# Altium project EM.PrjPCB
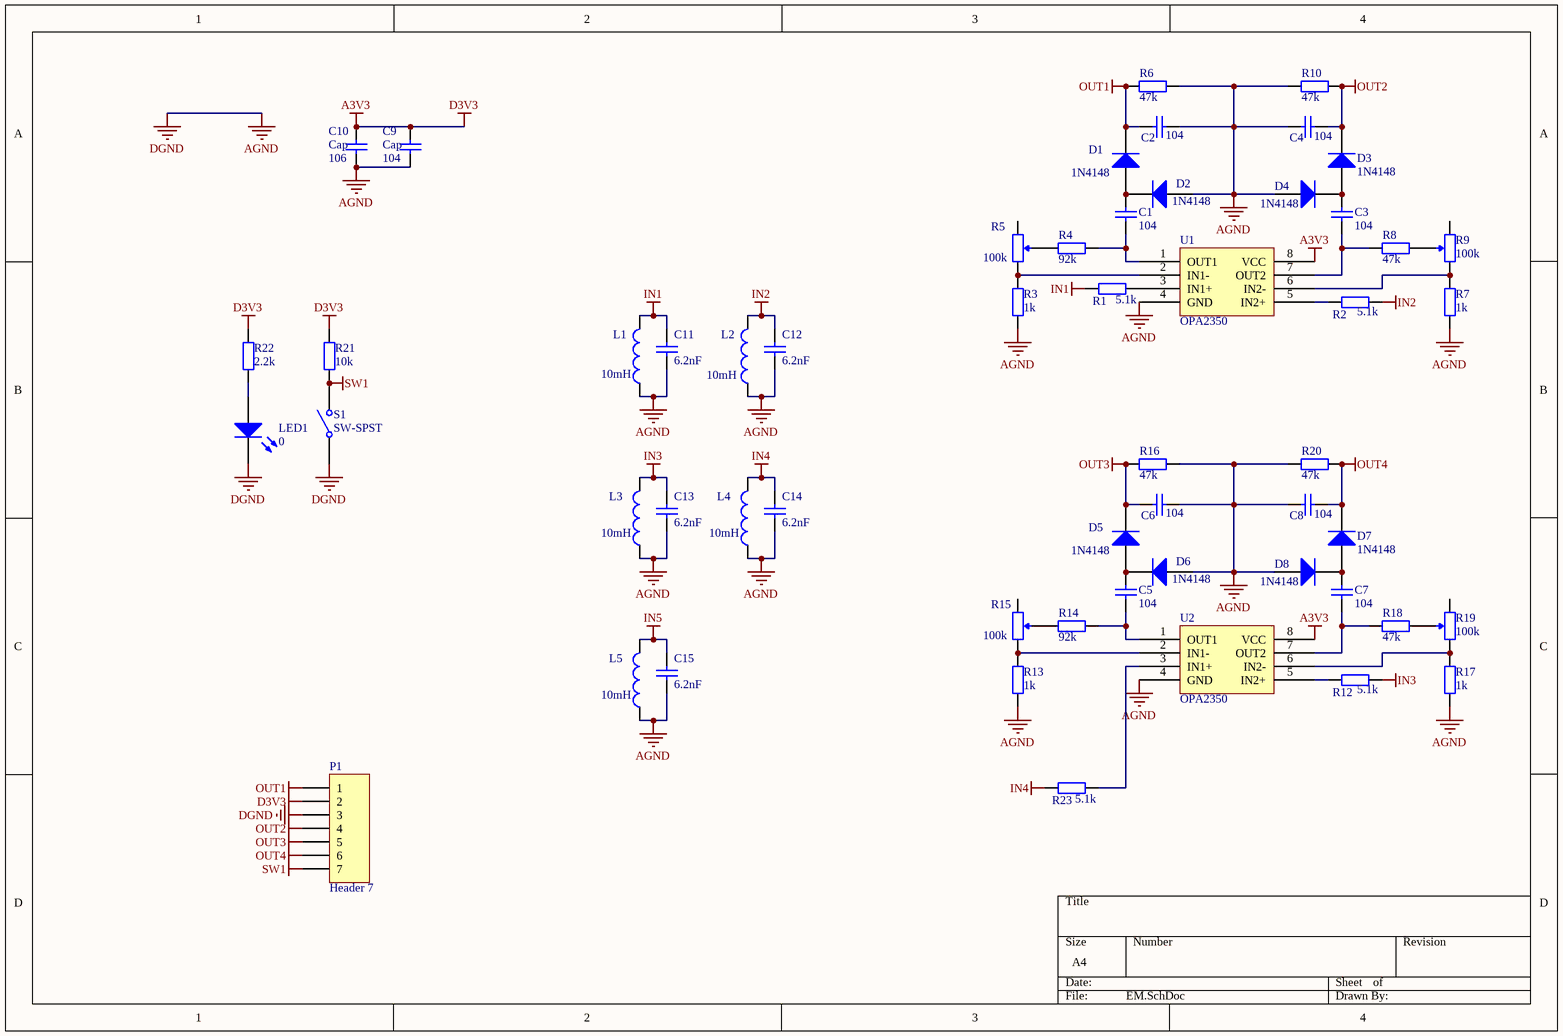
[diagram p0: EM.SchDoc]
2 sheets, 66 parts. Net scope: global (net labels, ports and power ports of the same name join across sheets).
Board files: EM.PcbDoc, ganhuangguan.PcbDoc
Sheets:
  EM.SchDoc
  Ganhuangguan.SchDoc

## Sheet EM.SchDoc
size A4

### Parts
C1  value 104  [0603C]  (hidden comment: Cap)
C2  value 104  [0603C]  (hidden comment: Cap)
C3  value 104  [0603C]  (hidden comment: Cap)
C4  value 104  [0603C]  (hidden comment: Cap)
C5  value 104  [0603C]  (hidden comment: Cap)
C6  value 104  [0603C]  (hidden comment: Cap)
C7  value 104  [0603C]  (hidden comment: Cap)
C8  value 104  [0603C]  (hidden comment: Cap)
C9  Cap  value 104  [0603C]
C10  Cap  value 106  [0805]
C11  value 6.2nF  [Cap2]  (hidden comment: Cap)
C12  value 6.2nF  [Cap2]  (hidden comment: Cap)
C13  value 6.2nF  [Cap2]  (hidden comment: Cap)
C14  value 6.2nF  [Cap2]  (hidden comment: Cap)
C15  value 6.2nF  [Cap2]  (hidden comment: Cap)
D1  1N4148  [SOD123]
D2  1N4148  [SOD123]
D3  1N4148  [SOD123]
D4  1N4148  [SOD123]
D5  1N4148  [SOD123]
D6  1N4148  [SOD123]
D7  1N4148  [SOD123]
D8  1N4148  [SOD123]
L1  value 10mH  [L2]  (hidden comment: Inductor)
L2  value 10mH  [L2]  (hidden comment: Inductor)
L3  value 10mH  [L2]  (hidden comment: Inductor)
L4  value 10mH  [L2]  (hidden comment: Inductor)
L5  value 10mH  [L2]  (hidden comment: Inductor)
LED1  0  [0603C]
P1  Header 7  [HDR1X7]
R1  value 5.1k  [0603C]  (hidden comment: Res2)
R2  value 5.1k  [0603C]  (hidden comment: Res2)
R3  value 1k  [0603C]  (hidden comment: Res2)
R4  value 92k  [0603C]  (hidden comment: Res2)
R5  value 100k  [W102/3296w]  (hidden comment: Res2)
R6  value 47k  [0603C]  (hidden comment: Res2)
R7  value 1k  [0603C]  (hidden comment: Res2)
R8  value 47k  [0603C]  (hidden comment: Res2)
R9  value 100k  [W102/3296w]  (hidden comment: Res2)
R10  value 47k  [0603C]  (hidden comment: Res2)
R12  value 5.1k  [0603C]  (hidden comment: Res2)
R13  value 1k  [0603C]  (hidden comment: Res2)
R14  value 92k  [0603C]  (hidden comment: Res2)
R15  value 100k  [W102/3296w]  (hidden comment: Res2)
R16  value 47k  [0603C]  (hidden comment: Res2)
R17  value 1k  [0603C]  (hidden comment: Res2)
R18  value 47k  [0603C]  (hidden comment: Res2)
R19  value 100k  [W102/3296w]  (hidden comment: Res2)
R20  value 47k  [0603C]  (hidden comment: Res2)
R21  value 10k  [0603C]  (hidden comment: Res2)
R22  value 2.2k  [0603R]  (hidden comment: Res2)
R23  value 5.1k  [0603C]  (hidden comment: Res2)
S1  SW-SPST  [SW_REED]
U1  OPA2350  [SOIC-8]
U2  OPA2350  [SOIC-8]

### Nets
A3V3: C9.2 C10.2 P1.2 R21.2 R22.2 U1.8(VCC) U2.8(VCC)  [also labelled D3V3]
AGND: C2.2 C4.2 C6.2 C8.2 C9.1 C10.1 C11.1 C12.1 C13.1 C14.1 C15.1 D2.1(A) D4.1(A) D6.1(A) D8.1(A) L1.1 L2.1 L3.2 L4.2 L5.2 LED1.2(K) P1.3 R3.1 R6.2 R7.1 R10.2 R13.1 R16.2 R17.1 R20.2 S1.1(COMMON) U1.4(GND) U2.4(GND)  [also labelled DGND]
IN1: C11.2 L1.2 R1.1
IN2: C12.2 L2.2 R2.1
IN3: C13.2 L3.1 R12.1
IN4: C14.2 L4.1 R23.1
IN5: C15.2 L5.1
OUT1: C2.1 D1.2(K) P1.1 R6.1
OUT2: C4.1 D3.2(K) P1.4 R10.1
OUT3: C6.1 D5.2(K) P1.5 R16.1
OUT4: C8.1 D7.2(K) P1.6 R20.1
SW1: P1.7 R21.1 S1.2(NO)
NetC1_1: C1.1 R4.2 U1.1(OUT1)
NetC1_2: C1.2 D1.1(A) D2.2(K)
NetC3_1: C3.1 R8.2 U1.7(OUT2)
NetC3_2: C3.2 D3.1(A) D4.2(K)
NetC5_1: C5.1 R14.2 U2.1(OUT1)
NetC5_2: C5.2 D5.1(A) D6.2(K)
NetC7_1: C7.1 R18.2 U2.7(OUT2)
NetC7_2: C7.2 D7.1(A) D8.2(K)
NetLED1_1: LED1.1(A) R22.1
NetR1_2: R1.2 U1.3(IN1+)
NetR2_2: R2.2 U1.5(IN2+)
NetR3_2: R3.2 R5.1 U1.2(IN1-)
NetR4_1: R4.1 R5.3
NetR7_2: R7.2 R9.1 U1.6(IN2-)
NetR8_1: R8.1 R9.3
NetR12_2: R12.2 U2.5(IN2+)
NetR13_2: R13.2 R15.1 U2.2(IN1-)
NetR14_1: R14.1 R15.3
NetR17_2: R17.2 R19.1 U2.6(IN2-)
NetR18_1: R18.1 R19.3
NetR23_2: R23.2 U2.3(IN1+)

### Library data of the parts
C1-C15 = Cap: Capacitor; Published: 8-Jun-2000; LatestRevisionDate: 17-Jul-2002; LatestRevisionNote: Re-released for DXP Platform.; PackageReference: RAD-0.3; Publisher: Altium Limited; PackageDescription: Radial Cap, Thru-Hole; 2 Leads; 0.3 in Pin Spacing
D1-D8 = Diode_2: Default Diode; Published: 8-Jun-2000; LatestRevisionDate: 17-Jul-2002; LatestRevisionNote: Re-released for DXP Platform.; PackageVersion: Sep-1996; PackageReference: SMC; Publisher: Altium Limited; PackageDescription: DO-214-AB/SMC; 2 C-Bend Leads; Body 7.9 x 5.9 mm, inc. leads (LxW); Code_JEDEC: DO-214-AB
L1-L5 = Inductor_2: Code_IEC: 1005; Published: 8-Jun-2000; LatestRevisionDate: 29-May-2009; LatestRevisionNote: IPC-7351 Footprint Added.; PackageReference: 0402-A; Publisher: Altium Limited; PackageDescription: Chip Inductor; Code_JEITA: 0402
LED1 = LED2: Typical RED, GREEN, YELLOW, AMBER GaAs LED; Published: 8-Jun-2000; LatestRevisionDate: 17-Jul-2002; LatestRevisionNote: Re-released for DXP Platform.; PackageVersion: Feb-2002; PackageReference: 3.2X1.6X1.1; Publisher: Altium Limited; PackageDescription: SM LED; 2 Flat Leads
P1 = Header 7: Header, 7-Pin; LatestRevisionDate: 17-Jul-2002; LatestRevisionNote: Re-released for DXP Platform.; Publisher: Altium Limited
R1-R4 R6-R8 R10 R12-R14 R16-R18 R20-R23 = Res2: Resistor; Published: 8-Jun-2000; LatestRevisionDate: 17-Jul-2002; LatestRevisionNote: Re-released for DXP Platform.; PackageReference: AXIAL-0.4; Publisher: Altium Limited; PackageDescription: Axial Device, Thru-Hole; 2 Leads; 0.4 in Pin Spacing
R5 R9 R15 R19 = RP: Resistor; Published: 8-Jun-2000; LatestRevisionDate: 17-Jul-2002; LatestRevisionNote: Re-released for DXP Platform.; PackageReference: AXIAL-0.4; Publisher: Altium Limited; PackageDescription: Axial Device, Thru-Hole; 2 Leads; 0.4 in Pin Spacing
S1 = SW-SPST: Single-Pole, Single-Throw Switch; Published: 24-Mar-1999; LatestRevisionDate: 17-Jul-2002; LatestRevisionNote: Re-released for DXP Platform.; PackageReference: SPST-2; Publisher: Altium Limited; PackageDescription: Switch; 2 Leads

## Sheet Ganhuangguan.SchDoc
size A4
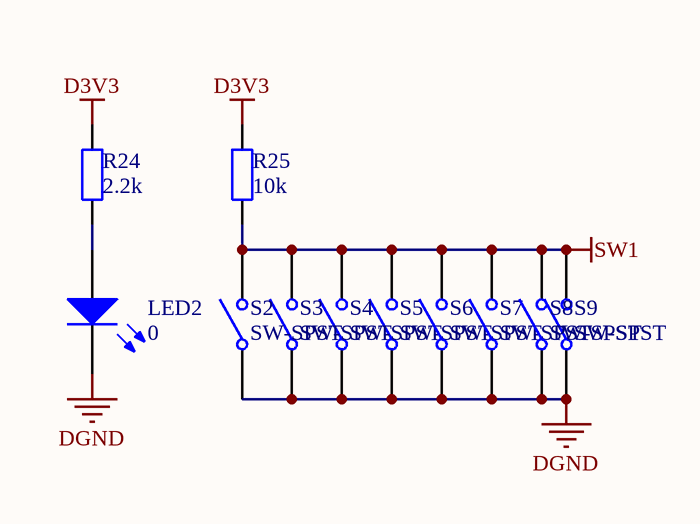
[diagram p1: Ganhuangguan.SchDoc]

### Parts
LED2  0  [0603C]
R24  value 2.2k  [0603R]  (hidden comment: Res2)
R25  value 10k  [0603C]  (hidden comment: Res2)
S2  SW-SPST  [SW_REED]
S3  SW-SPST  [SW_REED]
S4  SW-SPST  [SW_REED]
S5  SW-SPST  [SW_REED]
S6  SW-SPST  [SW_REED]
S7  SW-SPST  [SW_REED]
S8  SW-SPST  [SW_REED]
S9  SW-SPST  [SW_REED]

### Nets
D3V3: R24.2 R25.2  [project net A3V3]
DGND: LED2.2(K) S2.1(COMMON) S3.1(COMMON) S4.1(COMMON) S5.1(COMMON) S6.1(COMMON) S7.1(COMMON) S8.1(COMMON) S9.1(COMMON)  [project net AGND]
SW1: R25.1 S2.2(NO) S3.2(NO) S4.2(NO) S5.2(NO) S6.2(NO) S7.2(NO) S8.2(NO) S9.2(NO)
NetLED2_1: LED2.1(A) R24.1

### Library data of the parts
LED2 = LED2: as LED1 on sheet EM; Published: 8-Jun-2000; LatestRevisionDate: 17-Jul-2002; LatestRevisionNote: Re-released for DXP Platform.; PackageVersion: Feb-2002; PackageReference: 3.2X1.6X1.1; Publisher: Altium Limited; PackageDescription: SM LED; 2 Flat Leads
R24 R25 = Res2: Resistor; Published: 8-Jun-2000; LatestRevisionDate: 17-Jul-2002; LatestRevisionNote: Re-released for DXP Platform.; PackageReference: AXIAL-0.4; Publisher: Altium Limited; PackageDescription: Axial Device, Thru-Hole; 2 Leads; 0.4 in Pin Spacing
S2-S9 = SW-SPST: Single-Pole, Single-Throw Switch; Published: 24-Mar-1999; LatestRevisionDate: 17-Jul-2002; LatestRevisionNote: Re-released for DXP Platform.; PackageReference: SPST-2; Publisher: Altium Limited; PackageDescription: Switch; 2 Leads

## Nets that join several sheets
A3V3: EM (7 pins), Ganhuangguan (R24.2 R25.2)
AGND: EM (33 pins), Ganhuangguan (9 pins)
SW1: EM (P1.7 R21.1 S1.2), Ganhuangguan (9 pins)